# Altium schematic sheet OSCILLAR_HFB_V1p0_FRP.SchDoc
size A4; DocumentNumber: 1; SheetNumber: 1; SheetTotal: 3; Title_: Front Page
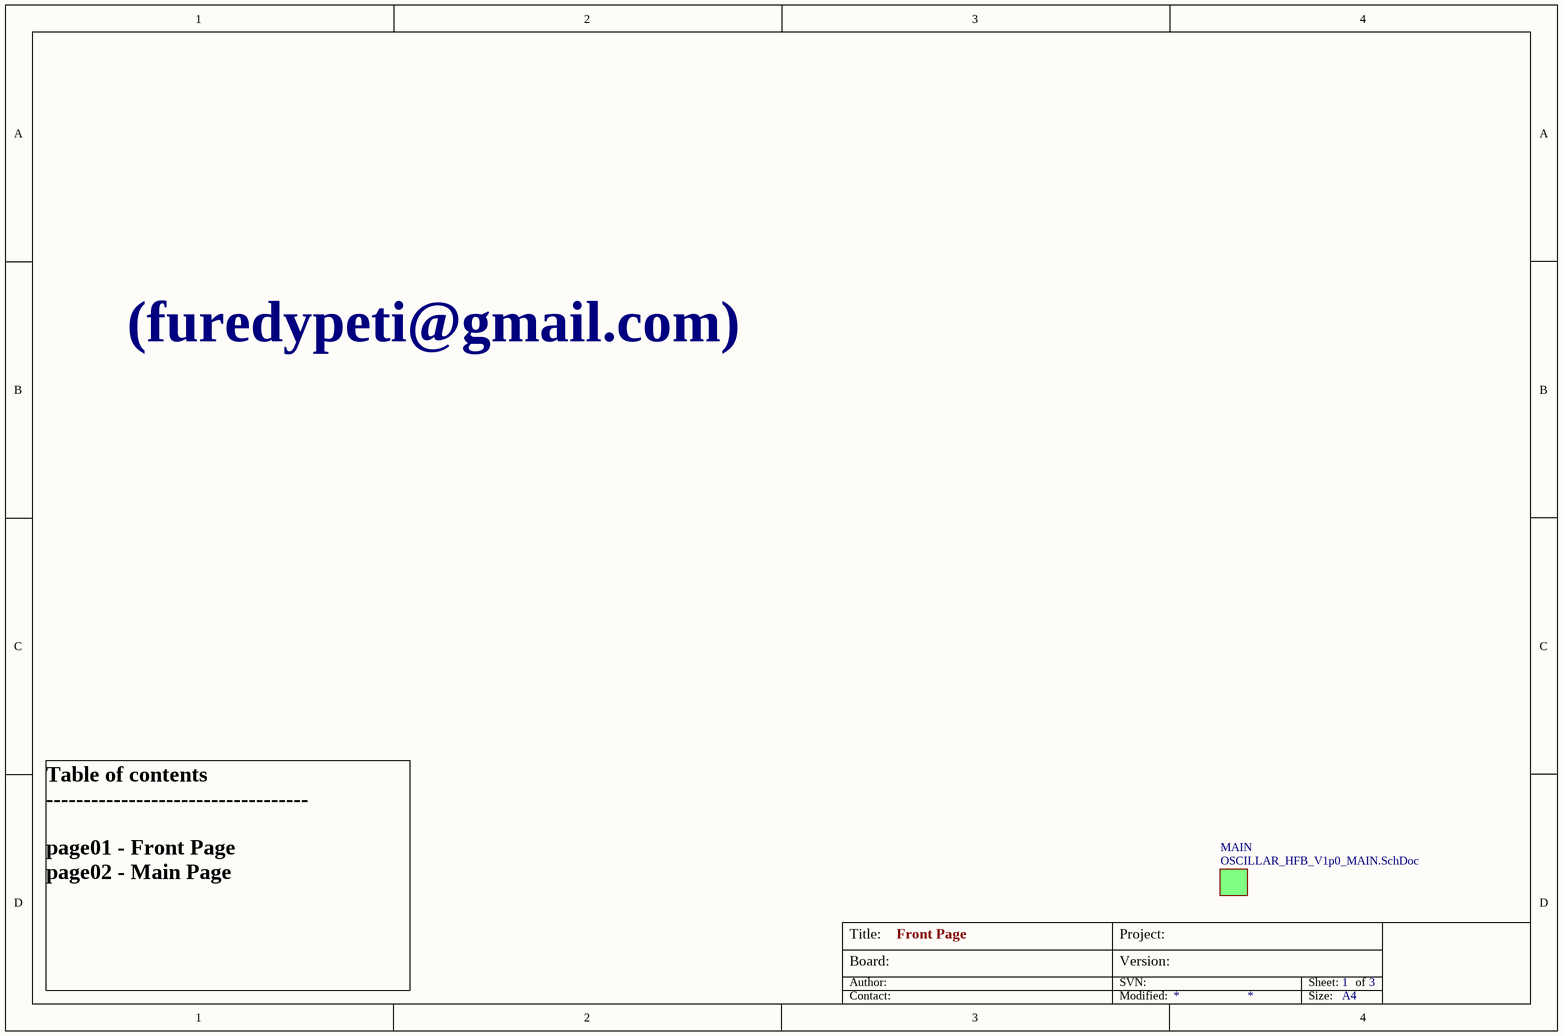
[diagram p0: OSCILLAR_HFB_V1p0_FRP.SchDoc]

## Sub-sheets
MAIN = OSCILLAR_HFB_V1p0_MAIN.SchDoc: no entries

## Notes on the sheet
- (furedypeti@gmail.com)
- Table of contents
  -----------------------------------
  page01 - Front Page
  page02 - Main Page
- Board:
- Author:
- Title:
- Project:
- SVN:
- Version:
- Sheet:
- of
- Contact:
- Modified:
- Size:
- A4